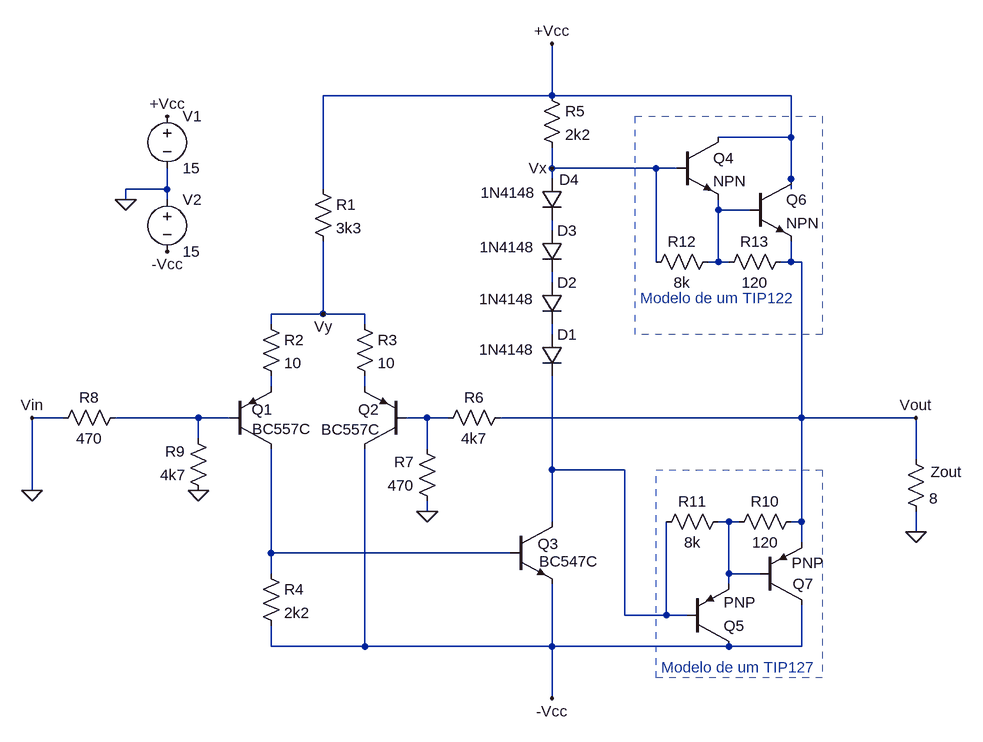
[diagram p0: schematic Amp_base_CC.asc]
Amp_base_CC.asc, the LTspice schematic file:
Version 4.1
SHEET 1 1512 688
WIRE 400 -336 400 -416
WIRE 400 -336 48 -336
WIRE 768 -336 400 -336
WIRE 768 -272 768 -336
WIRE 768 -272 656 -272
WIRE 400 -224 400 -256
WIRE 560 -224 400 -224
WIRE 592 -224 560 -224
WIRE 400 -208 400 -224
WIRE 768 -208 768 -272
WIRE -192 -192 -192 -224
WIRE -192 -192 -256 -192
WIRE 48 -192 48 -336
WIRE 768 -192 768 -208
WIRE -256 -176 -256 -192
WIRE -192 -176 -192 -192
WIRE 656 -160 656 -176
WIRE 704 -160 656 -160
WIRE 400 -128 400 -144
WIRE 560 -80 560 -224
WIRE 656 -80 656 -160
WIRE 656 -80 640 -80
WIRE 672 -80 656 -80
WIRE 768 -80 768 -112
WIRE 768 -80 752 -80
WIRE 784 -80 768 -80
WIRE 400 -48 400 -64
WIRE 48 0 48 -112
WIRE 48 0 -32 0
WIRE 112 0 48 0
WIRE -32 16 -32 0
WIRE 112 16 112 0
WIRE 400 32 400 16
WIRE -32 112 -32 96
WIRE 112 112 112 96
WIRE -352 160 -400 160
WIRE -144 160 -272 160
WIRE -96 160 -144 160
WIRE 208 160 176 160
WIRE 240 160 208 160
WIRE 784 160 784 -80
WIRE 784 160 320 160
WIRE 960 160 784 160
WIRE -144 192 -144 160
WIRE 208 208 208 160
WIRE 960 224 960 160
WIRE 400 240 400 96
WIRE 512 240 400 240
WIRE -400 272 -400 160
WIRE 208 304 208 288
WIRE 400 320 400 240
WIRE 672 320 656 320
WIRE 688 320 672 320
WIRE 784 320 784 160
WIRE 784 320 768 320
WIRE 960 336 960 304
WIRE 784 352 784 320
WIRE -32 368 -32 208
WIRE 336 368 -32 368
WIRE -32 400 -32 368
WIRE 672 400 672 320
WIRE 720 400 672 400
WIRE 672 416 672 400
WIRE 512 464 512 240
WIRE 576 464 576 320
WIRE 576 464 512 464
WIRE 608 464 576 464
WIRE -32 512 -32 480
WIRE 112 512 112 208
WIRE 112 512 -32 512
WIRE 400 512 400 416
WIRE 400 512 112 512
WIRE 672 512 400 512
WIRE 784 512 784 448
WIRE 784 512 672 512
WIRE 400 592 400 512
FLAG -400 272 0
FLAG -256 -176 0
FLAG -192 -304 +Vcc
FLAG 400 -416 +Vcc
FLAG -192 -96 -Vcc
FLAG 400 592 -Vcc
FLAG -144 272 0
FLAG 208 304 0
FLAG 960 160 Vout
FLAG 960 336 0
FLAG -400 160 Vin
FLAG 48 0 Vy
FLAG 400 -224 Vx
SYMBOL voltage -192 -320 R0
WINDOW 123 24 44 Left 2
WINDOW 39 0 0 Left 0
SYMATTR InstName V1
SYMATTR Value 15
SYMBOL voltage -192 -192 R0
WINDOW 123 0 0 Left 0
WINDOW 39 0 0 Left 0
SYMATTR InstName V2
SYMATTR Value 15
SYMBOL res 32 -208 R0
SYMATTR InstName R1
SYMATTR Value 3k3
SYMBOL res -48 0 R0
SYMATTR InstName R2
SYMATTR Value 10
SYMBOL res 96 0 R0
SYMATTR InstName R3
SYMATTR Value 10
SYMBOL res -48 384 R0
SYMATTR InstName R4
SYMATTR Value 2k2
SYMBOL res 384 -352 R0
SYMATTR InstName R5
SYMATTR Value 2k2
SYMBOL res 336 144 R90
WINDOW 0 0 56 VBottom 2
WINDOW 3 32 56 VTop 2
SYMATTR InstName R6
SYMATTR Value 4k7
SYMBOL res 224 304 R180
WINDOW 0 36 76 Left 2
WINDOW 3 36 40 Left 2
SYMATTR InstName R7
SYMATTR Value 470
SYMBOL res 784 304 R90
WINDOW 0 0 56 VBottom 2
WINDOW 3 32 56 VTop 2
SYMATTR InstName R10
SYMATTR Value 120
SYMBOL res 672 304 R90
WINDOW 0 0 56 VBottom 2
WINDOW 3 32 56 VTop 2
SYMATTR InstName R11
SYMATTR Value 8k
SYMBOL res 656 -96 R90
WINDOW 0 0 56 VBottom 2
WINDOW 3 32 56 VTop 2
SYMATTR InstName R12
SYMATTR Value 8k
SYMBOL res 768 -96 R90
WINDOW 0 0 56 VBottom 2
WINDOW 3 32 56 VTop 2
SYMATTR InstName R13
SYMATTR Value 120
SYMBOL diode 384 32 R0
WINDOW 3 -96 23 Left 2
SYMATTR Value 1N4148
SYMATTR InstName D1
SYMBOL diode 384 -48 R0
WINDOW 3 -96 25 Left 2
SYMATTR Value 1N4148
SYMATTR InstName D2
SYMBOL diode 384 -128 R0
WINDOW 3 -95 25 Left 2
SYMATTR Value 1N4148
SYMATTR InstName D3
SYMBOL diode 384 -208 R0
WINDOW 0 27 1 Left 2
WINDOW 3 -94 21 Left 2
SYMATTR InstName D4
SYMATTR Value 1N4148
SYMBOL npn 336 320 R0
WINDOW 0 42 34 Left 2
WINDOW 3 44 61 Left 2
SYMATTR InstName Q3
SYMATTR Value BC547C
SYMBOL npn 592 -272 R0
SYMATTR InstName Q4
SYMBOL pnp 608 512 M180
SYMATTR InstName Q5
SYMBOL npn 704 -208 R0
SYMATTR InstName Q6
SYMBOL pnp 720 448 M180
WINDOW 0 50 32 Left 2
WINDOW 3 49 65 Left 2
SYMATTR InstName Q7
SYMBOL pnp -96 208 M180
WINDOW 0 34 61 Left 2
WINDOW 3 35 31 Left 2
SYMATTR InstName Q1
SYMATTR Value BC557C
SYMBOL pnp 176 208 R180
WINDOW 0 42 61 Left 2
WINDOW 3 40 30 Left 2
SYMATTR InstName Q2
SYMATTR Value BC557C
SYMBOL res -256 144 R90
WINDOW 0 0 56 VBottom 2
WINDOW 3 32 56 VTop 2
SYMATTR InstName R8
SYMATTR Value 470
SYMBOL res -128 288 R180
WINDOW 0 36 76 Left 2
WINDOW 3 36 40 Left 2
SYMATTR InstName R9
SYMATTR Value 4k7
SYMBOL res 944 208 R0
WINDOW 0 39 35 Left 2
SYMATTR InstName Zout
SYMATTR Value 8
TEXT 536 -24 Left 2 ;Modelo de um TIP122
TEXT 568 544 Left 2 ;Modelo de um TIP127
RECTANGLE Normal 816 32 528 -304 2
RECTANGLE Normal 816 560 560 240 2

The netlist it stands for:
* Amp_base_CC.asc
V1 +Vcc 0 15
V2 0 -Vcc 15
R1 +Vcc Vy 3k3
R2 Vy N005 10
R3 Vy N006 10
R4 N011 -Vcc 2k2
R5 +Vcc Vx 2k2
R6 Vout N008 4k7
R7 0 N008 470
R10 Vout N010 120
R11 N010 N009 8k
R12 N001 Vx 8k
R13 Vout N001 120
D1 N004 N009 1N4148
D2 N003 N004 1N4148
D3 N002 N003 1N4148
D4 Vx N002 1N4148
Q3 N009 N011 -Vcc 0 BC547C
Q4 +Vcc Vx N001 0 NPN
Q5 -Vcc N009 N010 0 PNP
Q6 +Vcc N001 Vout 0 NPN
Q7 -Vcc N010 Vout 0 PNP
Q1 N011 N007 N005 0 BC557C
Q2 -Vcc N008 N006 0 BC557C
R8 N007 0 470
R9 0 N007 4k7
R§Zout Vout 0 8
.model D D
.lib standard.dio
.model NPN NPN
.model PNP PNP
.lib standard.bjt
* Modelo de um TIP122
* Modelo de um TIP127
.backanno
.end